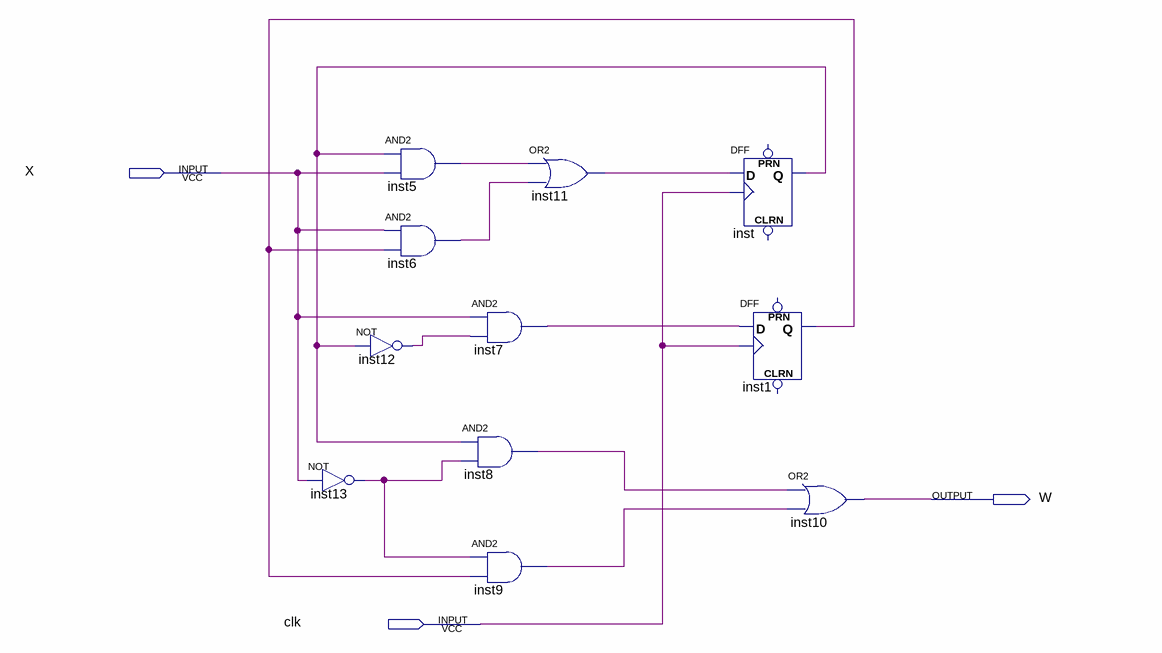
[diagram p0: schematic sheet]
// Quartus schematic stateDiagram.bdf as structural Verilog: 11 symbols, 3 pins
module stateDiagram (
  input  X,
  input  clk,
  output W
);

  wire inst1_q, inst5_out, inst6_out, inst7_out, inst8_out, inst9_out, inst11_out, inst12_out, inst13_out,
       inst_q;

  not inst13 (inst13_out, X);
  and inst5 (inst5_out, inst_q, X);
  and inst6 (inst6_out, X, inst1_q);
  not inst12 (inst12_out, inst_q);
  and inst7 (inst7_out, X, inst12_out);
  and inst8 (inst8_out, inst_q, inst13_out);
  and inst9 (inst9_out, inst13_out, inst1_q);
  or inst11 (inst11_out, inst5_out, inst6_out);
  DFF inst (.CLK(clk), .D(inst11_out), .Q(inst_q));  // open: CLRN, PRN
  DFF inst1 (.CLK(clk), .D(inst7_out), .Q(inst1_q));  // open: CLRN, PRN
  or inst10 (W, inst8_out, inst9_out);
endmodule
